# EAGLE design multi-pcb-9axis-sensor (EAGLE 9.6.2)
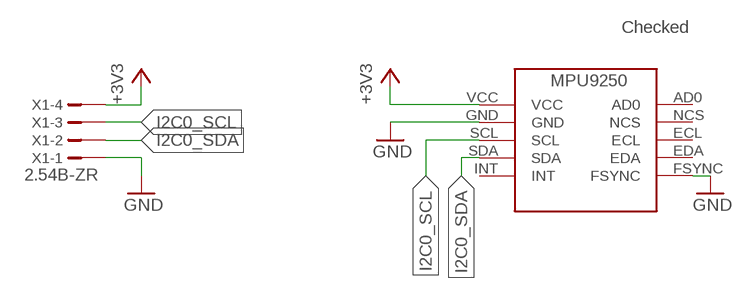
[diagram p0: schematic, sheet 1]

## Parts
U$3  MPU9250_BREAKOUT  [MPU9250_BREAKOUT]
X1  2.54B-ZR  [B4B-ZR2.5]

## Nets
+3V3: U$3.VCC X1.4
GND: U$3.FSYNC U$3.GND X1.1
I2C0_SCL: U$3.SCL X1.3
I2C0_SDA: U$3.SDA X1.2
Unconnected: U$3.AD0 U$3.ECL U$3.EDA U$3.INT U$3.NCS

## Notes on the sheet
- Checked

## Library data of the parts
U$3 = MPU9250:MPU9250_BREAKOUT
X1 = con-jst-custom:?4B-ZR: ZH CONNECTOR 1.5 mm, 4 pin 1 row Source: http://www.jst.com .. eZH.pdf

## Board
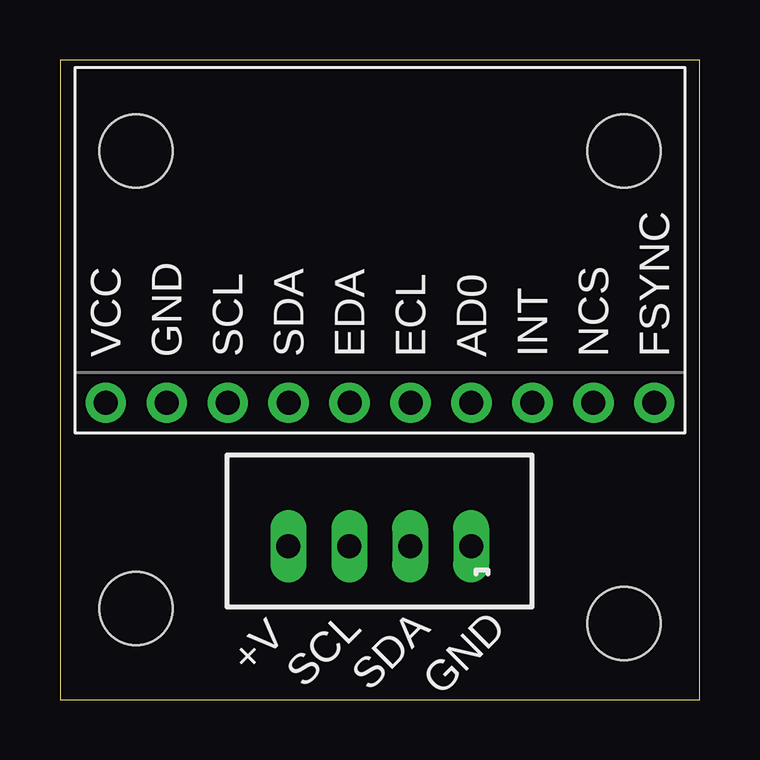
[diagram p1: board, top side]
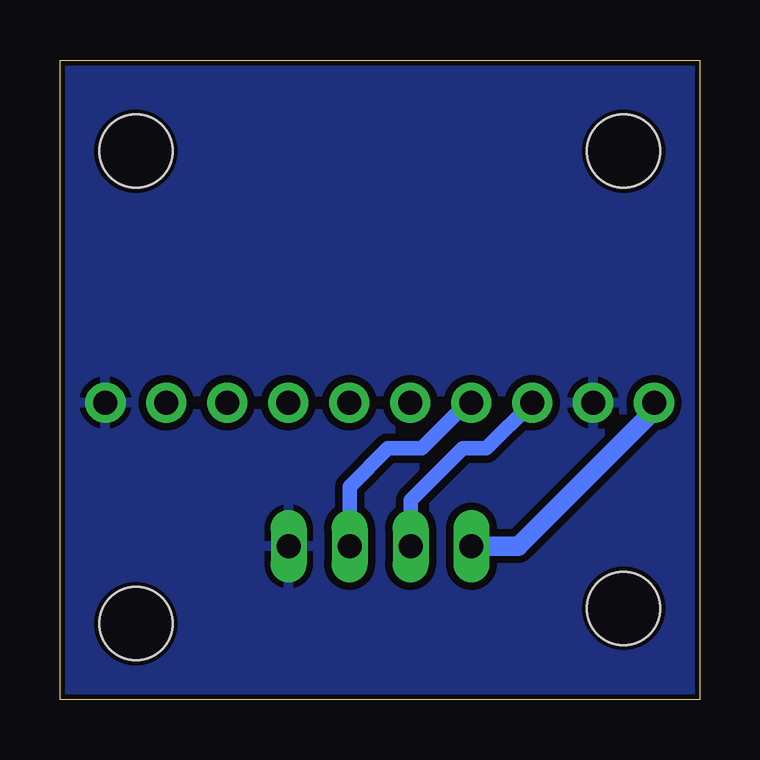
[diagram p2: board, bottom side, seen from below]

Size 26.66 x 26.66 mm. Coordinates in mm from the lower left corner, seen from the top.
Outline: 0,0 26.66,0 26.66,26.66 0,26.66 0,0
Copper layers (1*16): Top 0.035mm / dielectric 1.5mm / Bottom 0.035mm
Design rules "home-made-pcb": minimum track width 8mil, minimum drill 0.3mm, track to track 12mil, track to pad 8mil, pad to pad 10mil, via to via 10mil, smd to smd 6mil, copper to edge 8mil, drill to drill 10mil, minimum pad ring 10mil, minimum via ring 20mil, stop-mask expansion 4mil, vias tented up to drill 0mil, thermal gap 10mil
Holes 3.05 mm at 3.17,3.81 23.5,3.17 3.17,22.86 23.5,22.86

### Footprints (pad centres in the part's own frame; a part is rotated, then mirrored left to right if it is on the bottom)
MPU9250_BREAKOUT = drill 1 pad 1.676: AD0 -6.35,-3.81; ECL -6.35,-1.27; EDA -6.35,1.27; FSYNC -6.35,-11.43; GND -6.35,8.89; INT -6.35,-6.35; NCS -6.35,-8.89; SCL -6.35,6.35; SDA -6.35,3.81; VCC -6.35,11.43
B4B-ZR2.5 = drill 1 pad 1.422 long: 1 -3.825,0; 2 -1.283,0; 3 1.257,0; 4 3.797,0

### Placement (x,y rotation side)
U$3  13.34,18.73 90 top
X1  13.31,6.4 180 top

### Tracks (layer width: path | path; a pad name or v marks a point on that pad's centre or on a via)
+3V3
  Bottom 0.813: U$3.VCC 1.91,12.06 7.57,6.4 X1.4
GND
  pour Bottom: 0,26.67 0,0 26.67,0 26.67,26.67
I2C0_SCL
  Bottom 0.61: U$3.SCL 8.89,10.48 9.89,10.48 12.05,8.31 X1.3
I2C0_SDA
  Bottom 0.61: U$3.SDA 9.68,12.38 11.59,10.48 13,10.48 14.59,8.89 X1.2

### Text on the board
tNames: SCL | SDA | GND | +V